# EAGLE design SoundDetectorModule (EAGLE 7.7.0)
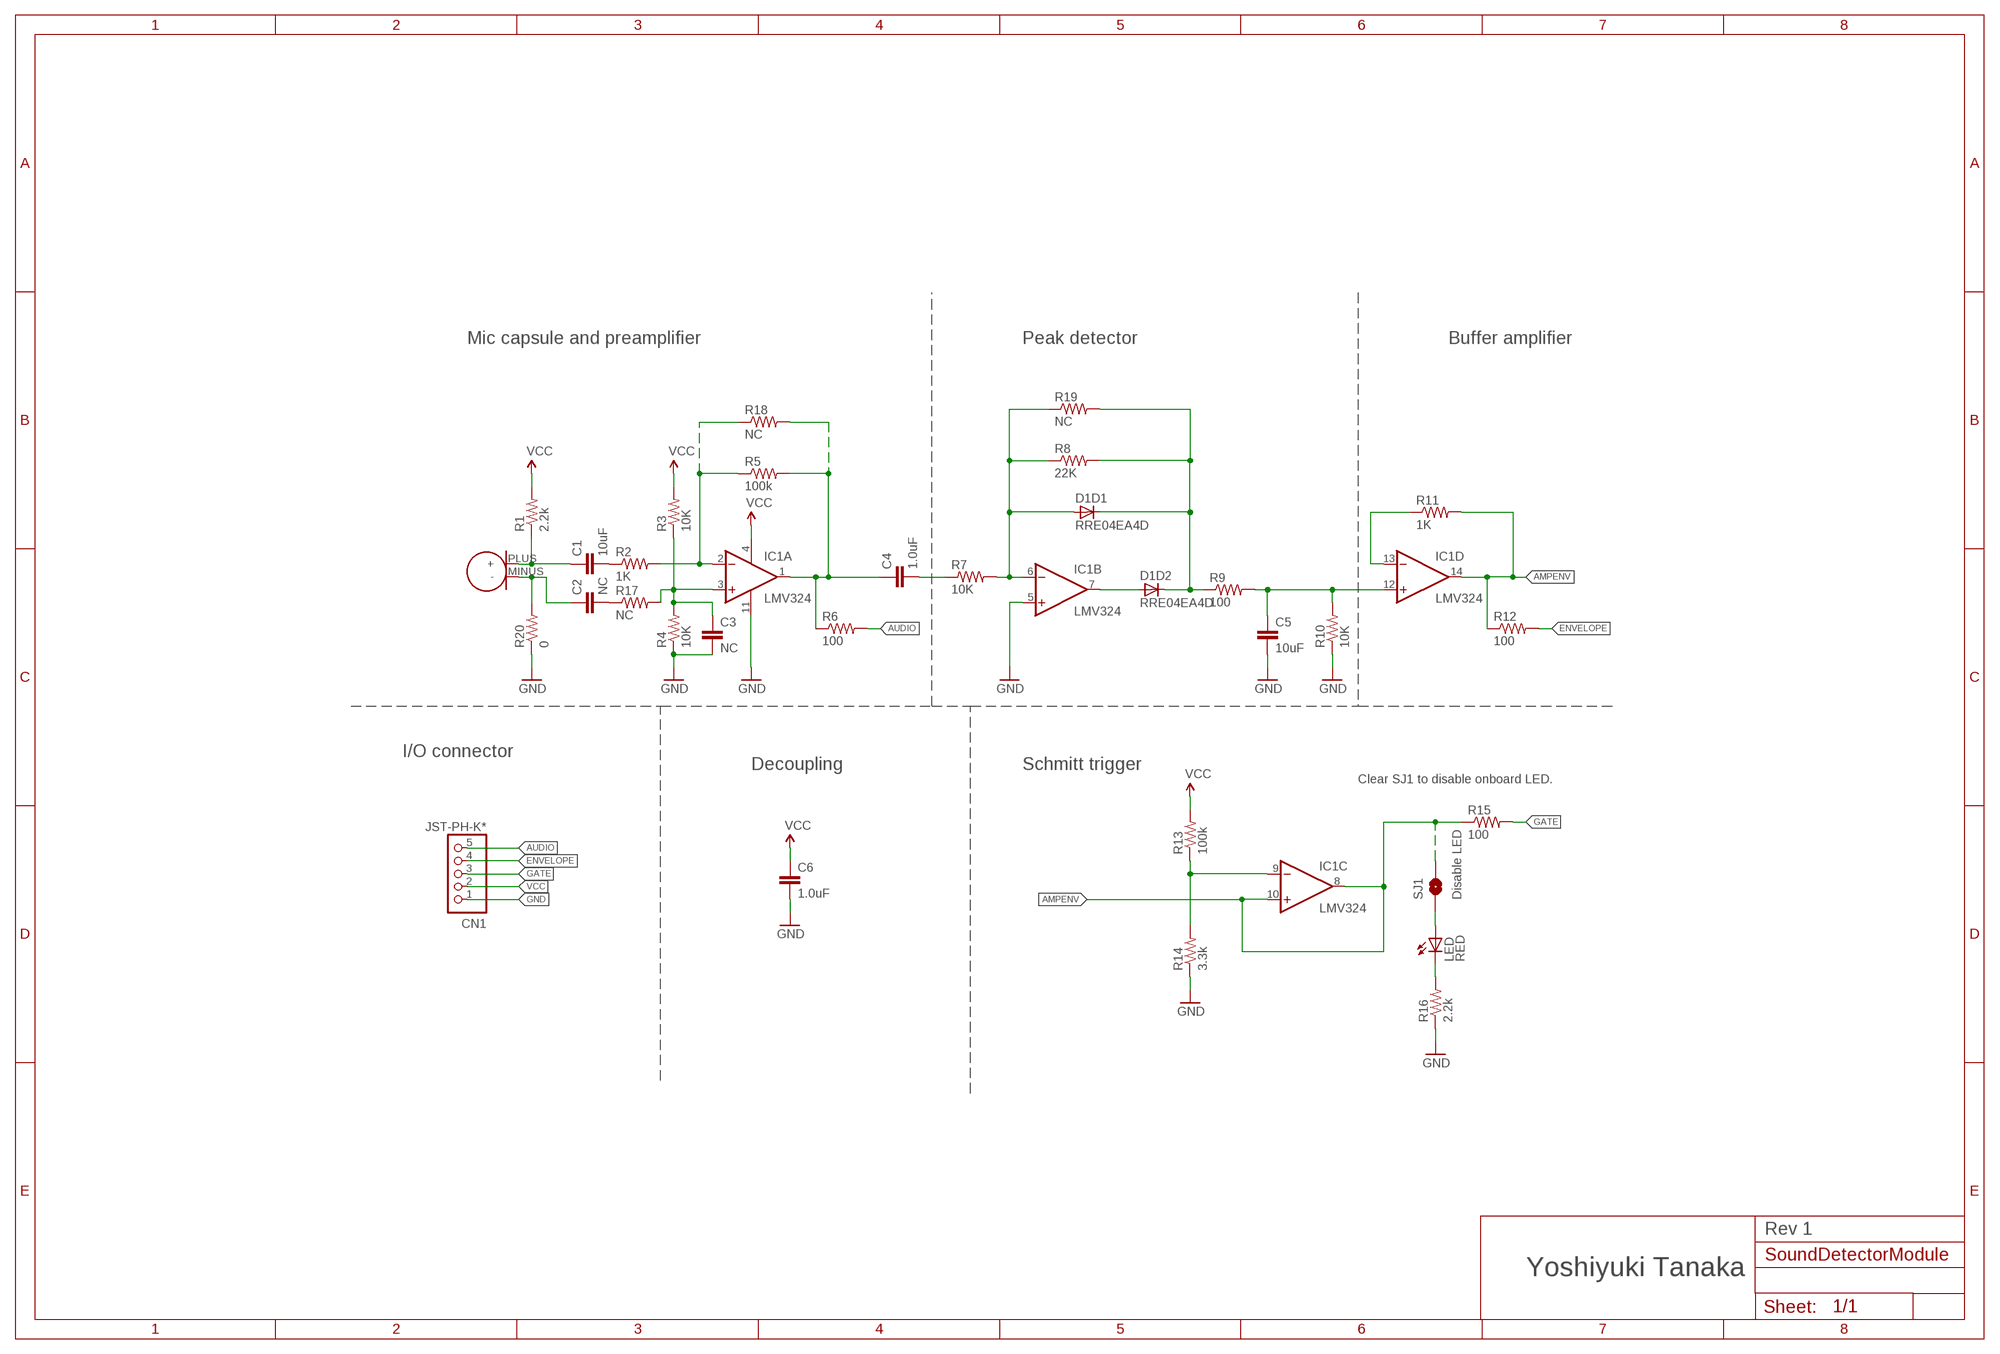
[diagram p0: schematic, sheet 1]

## Parts
A1  MO093803-3  [MO093803-3]
C1  10uF  C-EUC1206  [C1206]
C2  NC  C-EUC0603  [C0603]
C3  NC  C-EUC0603  [C0603]
C4  1.0uF  C-EUC0603  [C0603]
C5  10uF  C-EUC1206  [C1206]
C6  1.0uF  C-EUC0603  [C0603]
CN1  JST-PH-K*  B5B-PH-SM4-TB  [B5B-PH-SM4-TB]
D1  RRE04EA4D  [TSMD5]
IC1  LMV324  [SO14]
LED  RED  SML-E1X  [SML-E1X]
R1  2.2k  R-US_R0603  [R0603]
R2  1K  R-US_R0603  [R0603]
R3  10K  R-US_R0603  [R0603]
R4  10K  R-US_R0603  [R0603]
R5  100k  R-US_R0603  [R0603]
R6  100  R-US_R0603  [R0603]
R7  10K  R-US_R0603  [R0603]
R8  22K  R-US_R0603  [R0603]
R9  100  R-US_R0603  [R0603]
R10  10K  R-US_R0603  [R0603]
R11  1K  R-US_R0603  [R0603]
R12  100  R-US_R0603  [R0603]
R13  100k  R-US_R0603  [R0603]
R14  3.3k  R-US_R0603  [R0603]
R15  100  R-US_R0603  [R0603]
R16  2.2k  R-US_R0603  [R0603]
R17  NC  R-US_R0603  [R0603]
R18  NC  R-US_0207/7  [0207/7]
R19  NC  R-US_0207/7  [0207/7]
R20  0  R-US_R0603  [R0603]
SJ1  Disable LED  SOLDERJUMPERNC  [SJ_2S]

## Nets
AMPENV: IC1.8(C:OUT) IC1.10(C:+IN) IC1.14(D:OUT) R11.2 R12.1 R15.1 SJ1.2
AUDIO: CN1.5 R6.2
ENVELOPE: CN1.4 R12.2
GATE: CN1.3 R15.2
GND: C3.2 C5.2 C6.2 CN1.1 IC1.5(B:+IN) IC1.11(P:V-) R4.1 R10.1 R14.1 R16.1 R20.1
N$: C4.1 IC1.1(A:OUT) R5.2 R6.1 R18.2
N$1: A1.PLUS(+) C1.1 R1.1
N$2: C3.1 IC1.3(A:+IN) R3.1 R4.2 R17.2
N$3: LED.C R16.2
N$4: IC1.2(A:-IN) R2.2 R5.1 R18.1
N$5: C1.2 R2.1
N$6: C4.2 R7.1
N$7: D1.1(D1:A) IC1.6(B:-IN) R7.2 R8.1 R19.1
N$8: D1.3(D2:A) IC1.7(B:OUT)
N$9: D1.4(D2:C) D1.5(D1:C) R8.2 R9.1 R19.2
N$10: C5.1 IC1.12(D:+IN) R9.2 R10.2
N$11: IC1.13(D:-IN) R11.1
N$12: LED.A SJ1.1
N$13: C2.2 R17.1
N$14: A1.MINUS(-) C2.1 R20.2
N$15: IC1.9(C:-IN) R13.1 R14.2
VCC: C6.1 CN1.2 IC1.4(P:V+) R1.2 R3.2 R13.2

## Notes on the sheet
- Mic capsule and preamplifier | Peak detector | Buffer amplifier
- I/O connector
- Decoupling | Schmitt trigger
- Clear SJ1 to disable onboard LED.
- Rev 1
- Yoshiyuki Tanaka

## Library data of the parts
A1 = mouser:MO093803-3
C1-C6 = rcl:C-EU: CAPACITOR, European symbol
CN1 = jst-ph:B5B-PH-*: Wire-to-Board 2.0mm pitch top mount connector Source: http://www.jst-mfg.com/product/pdf/jpn/PH.pdf http://www.jst-mfg.com/product/detail.php?series=199
D1 = rohm2:RRE04EA4D
IC1 = ti:LMV324: Quad General Purpose, Low Voltage, Rail-to-Rail Output Operational Amplifiers Source: http://www.national.com/mpf/LM/LMV321.html http://www.national.com/dt/lmv_qual.pdf
LED = lazurite:SML-E1X
R1-R17 R20 = rcl:R-US_: RESISTOR, American symbol
R18 R19 = resistor:R-US_: RESISTOR, American symbol
SJ1 = SparkFun-Passives:SOLDERJUMPER: Solder Jumper Standard SMD solder jumper. Used to automate production. Two varients : Normally Open and Normally Closed are the same, but have different paste layers. NC will have a large amount of paste and should jumper during reflow.

## Board
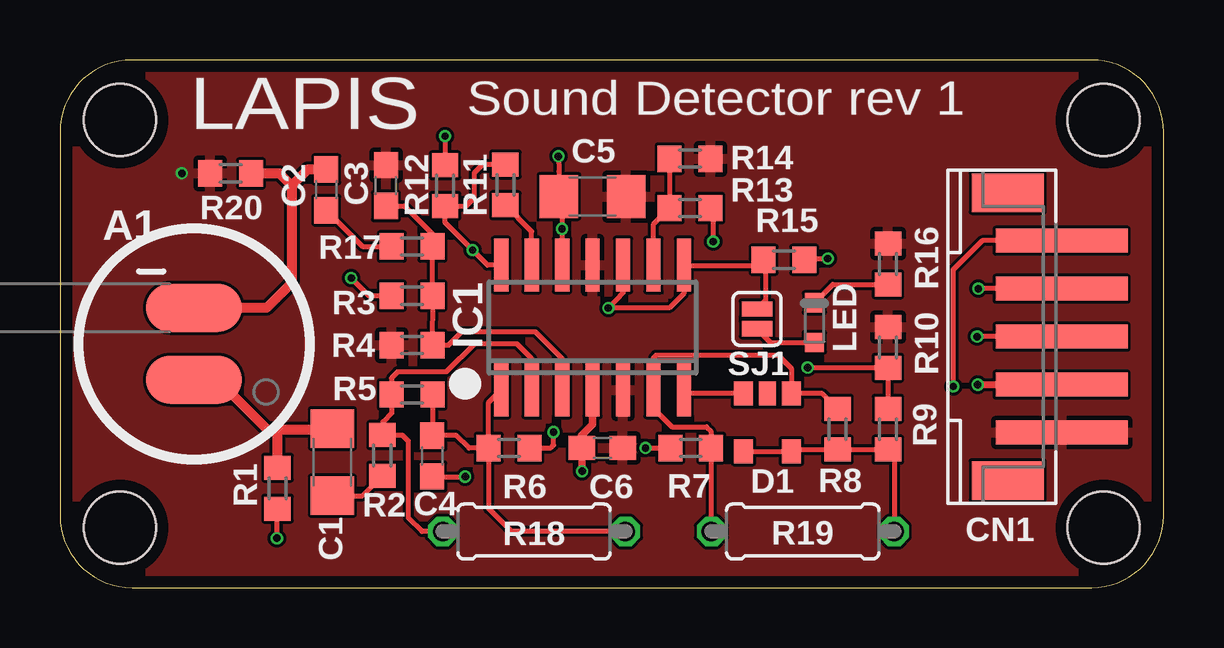
[diagram p1: board, top side]
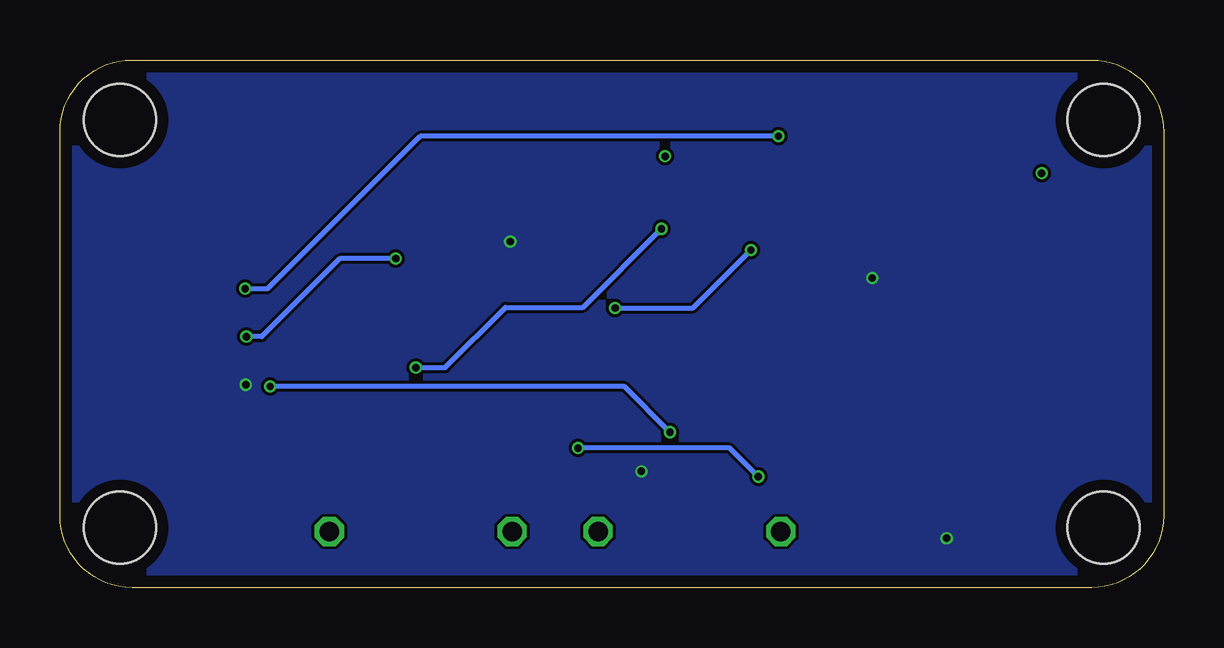
[diagram p2: board, bottom side, seen from below]

Size 46 x 22 mm. Coordinates in mm from the lower left corner, seen from the top.
Outline: 0,3 arc90 3,0 43,0 arc90 46,3 46,19 arc90 43,22 3,22 arc90 0,19 0,3
Copper layers (1*16): Top 0.018mm / dielectric 1.55mm / Bottom 0.018mm
Design rules "unicraft_2layer": minimum track width 0.125mm, minimum drill 0.25mm, track to track 0.125mm, track to pad 0.125mm, pad to pad 0.125mm, via to via 0.125mm, smd to smd 0mil, copper to edge 0.5mm, drill to drill 0.3mm, minimum pad ring 0.175mm, minimum via ring 0.1mm, stop-mask expansion 0mil, vias tented up to drill 0.45mm, thermal gap 0.2mm
Holes 3 mm at 2.5,2.5 43.5,19.5 43.5,2.5 2.5,19.5

### Footprints (pad centres in the part's own frame; a part is rotated, then mirrored left to right if it is on the bottom)
MO093803-3 = smd 4 x 2: MINUS 0,-1.5; PLUS 0,1.5
C1206 = smd 1.6 x 1.8: 1 -1.4,0; 2 1.4,0
C0603 = smd 1.1 x 1: 1 -0.85,0; 2 0.85,0
B5B-PH-SM4-TB = smd 1 x 5.5: 1 -4,-3.05; 2 -2,-3.05; 3 0,-3.05; 4 2,-3.05; 5 4,-3.05 | smd 1.6 x 3: S1 -6,-0.8; S2 6,-0.8
TSMD5 = smd 0.8 x 1: 1 -1,-1.2; 3 1,-1.2; 4 1,1.2; 5 -1,1.2 | smd 0.7 x 1: 2 0,-1.2
SO14 = smd 0.6 x 2.2: 1 -3.81,-2.6; 2 -2.54,-2.6; 3 -1.27,-2.6; 4 0,-2.6; 5 1.27,-2.6; 6 2.54,-2.6; 7 3.81,-2.6; 8 3.81,2.6; 9 2.54,2.6; 10 1.27,2.6; 11 0,2.6; 12 -1.27,2.6; 13 -2.54,2.6; 14 -3.81,2.6
SML-E1X = smd 0.8 x 0.8: A 0,-0.825; C 0,0.825
R0603 = smd 1 x 1.1: 1 -0.85,0; 2 0.85,0
0207/7 = drill 0.813 octagon: 1 -3.81,0; 2 3.81,0
SJ_2S = smd 0.635 x 1.27: 1 -0.412,0; 2 0.412,0

### Placement (x,y rotation side)
A1  5.59,10.16 180 top
C1  11.35,5.23 270 top
C2  11.1,16.59 270 top
C3  13.59,16.76 90 top
C4  15.52,5.49 270 top
C5  22.2,16.31 0 top
C6  22.61,5.82 0 top
CN1  38.71,10.46 90 top
D1  29.49,6.88 180 top
IC1  22.2,10.85 0 top
LED  31.45,11.05 0 top
R1  9.07,4.14 270 top
R2  13.44,5.51 90 top
R3  14.68,12.17 180 top
R4  14.68,10.11 0 top
R5  14.68,8.05 0 top
R6  18.72,5.82 0 top
R7  26.29,5.82 0 top
R8  32.41,6.6 270 top
R9  34.52,6.6 90 top
R10  34.52,10.01 270 top
R11  18.57,16.79 90 top
R12  16.05,16.76 90 top
R13  26.26,15.82 0 top
R14  26.26,17.88 180 top
R15  30.18,13.67 0 top
R16  34.52,13.49 270 top
R17  14.68,14.22 0 top
R18  19.76,2.34 0 top
R19  30.96,2.34 0 top
R20  7.11,17.27 0 top
SJ1  29.06,11.2 90 top

### Tracks (layer width: path | path; a pad name or v marks a point on that pad's centre or on a via)
AMPENV  (via drill 0.3)
  Top 0.203: R11.2 18.55,17.65 17.63,17.65 17.27,17.3 17.27,16.26 16.93,15.91 R12.1 16.05,15.21 v17.2,14.07 17.82,13.45 IC1.14 | IC1.10 23.47,12.29 v22.86,11.66 25.4,11.66 26.01,12.27 IC1.8 26.02,13.44 29.1,13.44 R15.1 29.41,13.58 29.41,11.97 SJ1.2 28.98,11.61
  Bottom 0.203: v22.86,11.66 19.61,11.66 v17.2,14.07
AUDIO  (via drill 0.3)
  Top 0.203: R6.2 19.58,5.83 20.46,5.83 20.57,5.94 v20.57,6.48 | CN1.5 38.44,14.46 37.24,13.26 v37.24,8.38
  Bottom 0.203: v37.24,8.38 22.48,8.38 v20.57,6.48
ENVELOPE  (via drill 0.3)
  Top 0.203: CN1.4 v38.28,12.46 | v16.05,18.82 R12.2
  Bottom 0.203: v16.05,18.82 30.99,18.82 37.34,12.46 v38.28,12.46
GATE  (via drill 0.3)
  Top 0.203: CN1.3 v38.23,10.46 | R15.2 31.08,13.72 v32,13.72
  Bottom 0.203: v32,13.72 34.34,13.72 37.59,10.46 v38.23,10.46
GND  (via drill 0.3)
  other vias: 5.08,17.27
  pour Top: -1.27,26.67 -1.27,0 46.99,0 46.99,26.67
N$
  Top 0.203: R5.2 15.53,6.35 C4.1 15.53,6.35 16.51,6.35 17.04,5.82 R6.1 | R6.1 17.87,7.73 IC1.1 | R6.1 17.87,4.99 | R18.2 18.82,2.34 17.88,3.28 17.88,5.8 R6.1
N$1
  Top 0.406: 9.14,6.6 8.64,6.6 6.58,8.66 A1.PLUS | 9.14,6.6 11.32,6.6 C1.1 | R1.1 9.07,6.53 9.14,6.6
N$2
  Top 0.203: IC1.3 20.93,9.55 19.81,10.67 16.76,10.67 16.2,10.11 R4.2 15.56,12.14 R3.1 R17.2 15.53,14.75 14.36,15.91 C3.1
N$3
  Top 0.203: LED.C 32.21,12.64 R16.2
N$4
  Top 0.203: 13.82,8.29 R5.1 | R5.1 13.83,7.28 13.46,6.91 13.46,6.39 R2.2 14.26,6.36 14.53,6.1 14.53,2.9 15.09,2.34 R18.1 | IC1.2 19.66,9.55 19.05,10.16 17.27,10.16 16.1,8.99 14.07,8.99 13.82,8.74 13.82,8.06 R5.1
N$5
  Top 0.203: C1.2 12.61,3.83 R2.1
N$6  (via drill 0.3)
  Top 0.203: C4.2 15.53,4.62 v16.89,4.62 | v24.41,5.82 R7.1
  Bottom 0.203: v16.89,4.62 18.09,5.82 v24.41,5.82
N$7
  Top 0.203: R8.1 31.78,8.08 D1.1 30.48,8.09 30.48,9.14 29.95,9.68 24.84,9.68 24.74,9.58 IC1.6 24.74,7.47 25.5,6.71 26.95,6.71 27.13,6.53 27.13,5.83 R7.2 27.14,2.35 R19.1
N$8
  Top 0.203: D1.3 26.17,8.08 IC1.7
N$9
  Top 0.203: D1.4 D1.5 30.56,5.75 R8.2 32.26,5.78 32.28,5.75 R9.1 34.77,5.5 R19.2
N$10  (via drill 0.3)
  Top 0.203: 20.95,15.8 C5.1 | v20.78,17.98 20.8,17.34 C5.1 | C5.1 20.93,16.18 v20.93,14.96 IC1.12 | v31.17,9.17 31.18,9.16 R10.2 R9.2
  Bottom 0.203: v20.93,14.96 24.21,11.68 27.43,11.68 29.95,9.17 v31.17,9.17
N$11
  Top 0.203: IC1.13 19.66,14.85 R11.1
N$12
  Top 0.203: SJ1.1 29.62,10.22 LED.A
N$13
  Top 0.203: C2.2 12.61,14.22 R17.1
N$14
  Top 0.406: C2.1 10.32,17.44 9.65,16.76 | 9.65,16.76 9.65,12.7 8.61,11.66 A1.MINUS | 7.82,17.13 R20.2 9.14,17.27 9.65,16.76
N$15
  Top 0.203: R14.2 R13.1 24.74,15.15 IC1.9
VCC  (via drill 0.3)
  Top 0.203: R13.2 27.23,16.04 v27.23,14.43 | R3.2 12.88,12.17 v12.14,12.9 | v9.04,2.06 9.04,3.27 R1.2
  Top 0.305: CN1.2 v38.25,8.46 | v21.77,4.85 21.76,4.86 C6.1 21.74,5.83 21.74,6.35 22.2,6.81 IC1.4
  pour Bottom: -2.54,29.21 -2.54,-1.27 48.26,-1.27 48.26,29.21

### Text on the board
tPlace: Sound Detector rev 1 | LAPIS